# Altium schematic sheet PCB OPTO FAST.SchDoc
size A
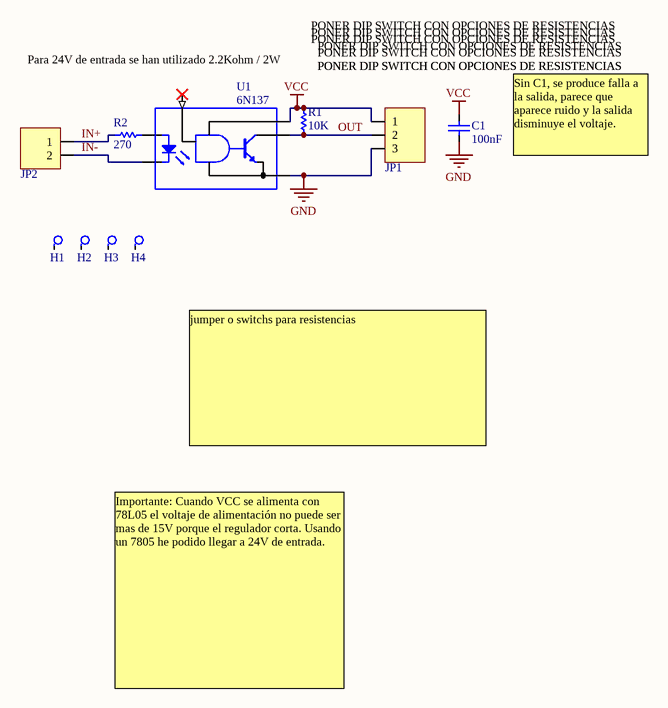
[diagram p0: PCB OPTO FAST.SchDoc]

## Parts
C1  Capacidad: 100nF  [C1206]  (hidden comment: Capacitor 1206; 100nF; 50V)
H1  Agujero de Montaje  [agujero]  (value not drawn)  (no BOM)
H2  Agujero de Montaje  [agujero]  (value not drawn)  (no BOM)
H3  Agujero de Montaje  [agujero]  (value not drawn)  (no BOM)
H4  Agujero de Montaje  [agujero]  (value not drawn)  (no BOM)
JP1  Header3x1  [conpol3x1]  (value not drawn)
JP2  Header2x1  [CONPOL2X1]  (value not drawn)
R1  value 10K  [R1206]  (hidden comment: Res)
R2  value 270  [R1206]  (hidden comment: Res)
U1  6N137  [DIP8Z]

## Nets
GND: C1.1 JP1.3 U1.5(GND)
VCC: C1.2 JP1.1 R1.2 U1.8(VCC)
IN+: JP2.1 R2.1
IN-: JP2.2 U1.3(K)
OUT: JP1.2 R1.1 U1.6(VO)
NetR2_2: R2.2 U1.2(A)

Not connected (* = marked no-connect by the designer): H1 1; H2 1; H3 1; H4 1; U1 7(VE)*

## Notes on the sheet
- Para 24V de entrada se han utilizado 2.2Kohm / 2W
- PONER DIP SWITCH CON OPCIONES DE RESISTENCIAS
- Sin C1, se produce falla a la salida, parece que aparece ruido y la salida disminuye el voltaje.
- jumper o switchs para resistencias
- Importante: Cuando VCC se alimenta con 78L05 el voltaje de alimentación no puede ser mas de 15V porque el regulador corta. Usando un 7805 he podido llegar a 24V de entrada.

## Library data of the parts
C1 = Capacitor 1206; 100nF; 50V: Dolares Elemon: 0.03125; Codigo Elemon: CA3269770K; Voltaje: 50V
JP1 = Header3x1: Header 3x1; Price: ?
JP2 = Header2x1: Header 2x1; Price: ?
R1 R2 = Res: Resistor; Power: 0.25W; Price: 0.036
U1 = 6N137: Optoaislador; Price: ?